# Altium schematic sheet ADS1298_2.SchDoc
size A4
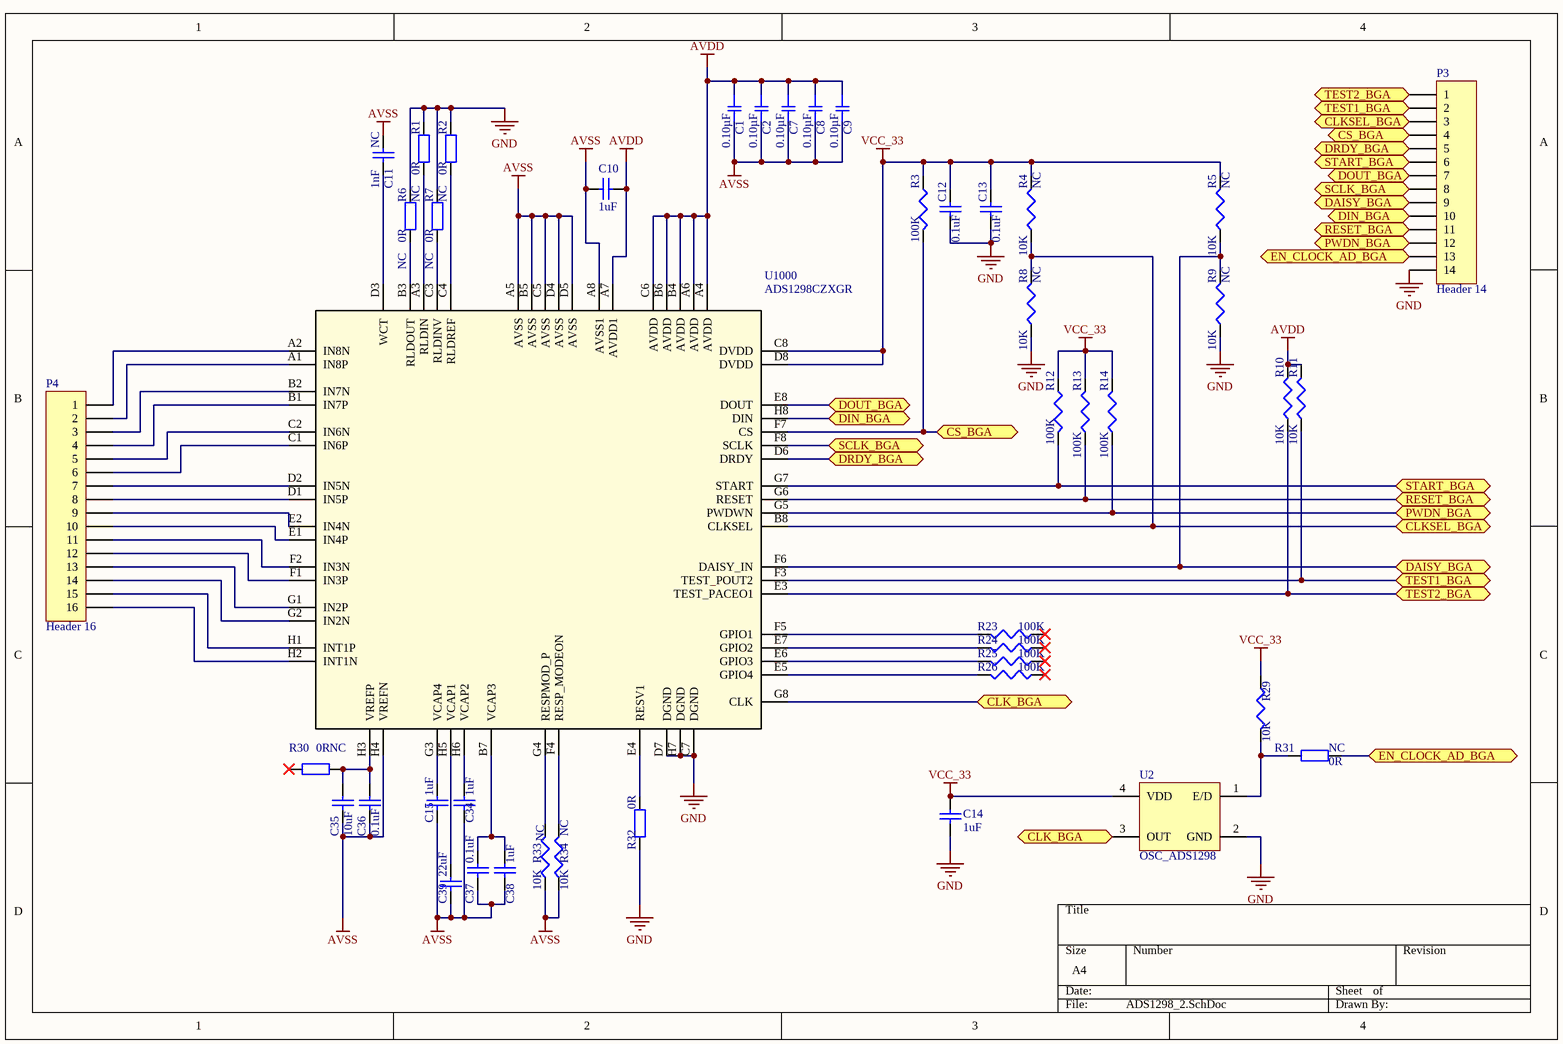
[diagram p0: ADS1298_2.SchDoc]

## Parts
C1  0.10µF  [SMD-0201C]
C2  0.10µF  [SMD-0201C]
C7  0.10µF  [SMD-0201C]
C8  0.10µF  [SMD-0201C]
C9  0.10µF  [SMD-0201C]
C10  value 1uF  [cap_0402_R - modified]  (hidden comment: Cap)
C11  NC  value 1nF  [cap_0402_R - modified]
C12  value 0.1uF  [cap_0402_R - modified]  (hidden comment: Cap)
C13  value 0.1uF  [cap_0402_R - modified]  (hidden comment: Cap)
C14  value 1uF  [cap_0402_R - modified]  (hidden comment: Cap)
C15  value 1uF  [cap_0402_R - modified]  (hidden comment: Cap)
C34  value 1uF  [cap_0402_R - modified]  (hidden comment: Cap)
C35  value 10uF  [cap_0402_R - modified]  (hidden comment: Cap)
C36  value 0.1uF  [cap_0402_R - modified]  (hidden comment: Cap)
C37  value 0.1uF  [cap_0402_R - modified]  (hidden comment: Cap)
C38  value 1uF  [cap_0402_R - modified]  (hidden comment: Cap)
C39  value 22uF  [cap_0402_R - modified]  (hidden comment: Cap)
P3  Header 14  [61301421121]
P4  Header 16  [61301621121]
R1  NC  value 0R  [cap_0402_R - modified]
R2  NC  value 0R  [cap_0402_R - modified]
R3  value 100K  [res_0402_R - modified]  (hidden comment: Res3)
R4  NC  value 10K  [cap_0402_R - modified]
R5  NC  value 10K  [cap_0402_R - modified]
R6  NC  value 0R  [cap_0402_R - modified]
R7  NC  value 0R  [cap_0402_R - modified]
R8  NC  value 10K  [cap_0402_R - modified]
R9  NC  value 10K  [cap_0402_R - modified]
R10  value 10K  [cap_0402_R - modified]
R11  value 10K  [cap_0402_R - modified]
R12  value 100K  [res_0402_R - modified]  (hidden comment: Res3)
R13  value 100K  [res_0402_R - modified]  (hidden comment: Res3)
R14  value 100K  [res_0402_R - modified]  (hidden comment: Res3)
R23  value 100K  [res_0402_R - modified]  (hidden comment: Res3)
R24  value 100K  [res_0402_R - modified]  (hidden comment: Res3)
R25  value 100K  [res_0402_R - modified]  (hidden comment: Res3)
R26  value 100K  [res_0402_R - modified]  (hidden comment: Res3)
R29  value 10K  [res_0402_R - modified]  (hidden comment: Res3)
R30  NC  value 0R  [cap_0402_R - modified]
R31  NC  value 0R  [cap_0402_R - modified]
R32  value 0R  [cap_0402_R - modified]
R33  NC  value 10K  [cap_0402_R - modified]
R34  NC  value 10K  [res_0402_R - modified]
U2  OSC_ADS1298  [HC735 - OSC ADS1298]
U1000  ADS1298CZXGR  [BGA64C80P8X8_800X800X106]

## Ports
CLK_BGA, CLKSEL_BGA, CS_BGA, DAISY_BGA, DIN_BGA, DOUT_BGA, DRDY_BGA, EN_CLOCK_AD_BGA (bidir), PWDN_BGA, RESET_BGA, SCLK_BGA, START_BGA, TEST1_BGA, TEST2_BGA

## Nets
AVDD: C1.1 C2.1 C7.1 C8.1 C9.1 C10.1 R10.2 R11.2 U1000.A4(AVDD) U1000.A6(AVDD) U1000.A7(AVDD1) U1000.B4(AVDD) U1000.B6(AVDD) U1000.C6(AVDD)
AVSS: C1.2 C2.2 C7.2 C8.2 C9.2 C10.2 C11.1 C15.1 C34.1 C35.1 C36.1 C37.1 C38.1 C39.1 R33.1 R34.1 U1000.A5(AVSS) U1000.A8(AVSS1) U1000.B5(AVSS) U1000.C5(AVSS) U1000.D4(AVSS) U1000.D5(AVSS) U1000.H4(VREFN)
GND: C12.1 C13.1 C14.2 P3.14 R1.1 R2.1 R6.1 R7.1 R8.1 R9.1 R32.2 U2.2(GND) U1000.C7(DGND) U1000.D7(DGND) U1000.H7(DGND)
VCC_33: C12.2 C13.2 C14.1 R3.1 R4.2 R5.2 R12.1 R13.2 R14.2 R29.1 U2.4(VDD) U1000.C8(DVDD) U1000.D8(DVDD)
CLK_BGA: U2.3(OUT) U1000.G8(CLK) ; port CLK_BGA
CLKSEL_BGA: P3.3 R4.1 R8.2 U1000.B8(CLKSEL) ; port CLKSEL_BGA
CS_BGA: P3.4 R3.2 U1000.F7(CS) ; port CS_BGA
DAISY_BGA: P3.9 R5.1 R9.2 U1000.F6(DAISY_IN) ; port DAISY_BGA
DIN_BGA: P3.10 U1000.H8(DIN) ; port DIN_BGA
DOUT_BGA: P3.7 U1000.E8(DOUT) ; port DOUT_BGA
DRDY_BGA: P3.5 U1000.D6(DRDY) ; port DRDY_BGA
EN_CLOCK_AD_BGA: P3.13 R31.1 ; port EN_CLOCK_AD_BGA
PWDN_BGA: P3.12 R14.1 U1000.G5(PWDWN) ; port PWDN_BGA
RESET_BGA: P3.11 R13.1 U1000.G6(RESET) ; port RESET_BGA
SCLK_BGA: P3.8 U1000.F8(SCLK) ; port SCLK_BGA
START_BGA: P3.6 R12.2 U1000.G7(START) ; port START_BGA
TEST1_BGA: P3.2 R11.1 U1000.F3(TEST_POUT2) ; port TEST1_BGA
TEST2_BGA: P3.1 R10.1 U1000.E3(TEST_PACEO1) ; port TEST2_BGA
NetC11_2: C11.2 U1000.D3(WCT)
NetC15_2: C15.2 U1000.G3(VCAP4)
NetC34_2: C34.2 U1000.H6(VCAP2)
NetC35_2: C35.2 C36.2 R30.2 U1000.H3(VREFP)
NetC37_2: C37.2 C38.2 U1000.B7(VCAP3)
NetC39_2: C39.2 U1000.H5(VCAP1)
NetP4_1: P4.1 U1000.A2(IN8N)
NetP4_2: P4.2 U1000.A1(IN8P)
NetP4_3: P4.3 U1000.B2(IN7N)
NetP4_4: P4.4 U1000.B1(IN7P)
NetP4_5: P4.5 U1000.C2(IN6N)
NetP4_6: P4.6 U1000.C1(IN6P)
NetP4_7: P4.7 U1000.D2(IN5N)
NetP4_8: P4.8 U1000.D1(IN5P)
NetP4_9: P4.9 U1000.E2(IN4N)
NetP4_10: P4.10 U1000.E1(IN4P)
NetP4_11: P4.11 U1000.F2(IN3N)
NetP4_12: P4.12 U1000.F1(IN3P)
NetP4_13: P4.13 U1000.G1(IN2P)
NetP4_14: P4.14 U1000.G2(IN2N)
NetP4_15: P4.15 U1000.H1(INT1P)
NetP4_16: P4.16 U1000.H2(INT1N)
NetR1_2: R1.2 U1000.A3(RLDIN)
NetR2_2: R2.2 U1000.C4(RLDREF)
NetR6_2: R6.2 U1000.B3(RLDOUT)
NetR7_2: R7.2 U1000.C3(RLDINV)
NetR23_2: R23.2 U1000.F5(GPIO1)
NetR24_2: R24.2 U1000.E7(GPIO2)
NetR25_2: R25.2 U1000.E6(GPIO3)
NetR26_2: R26.2 U1000.E5(GPIO4)
NetR29_2: R29.2 R31.2 U2.1(E/D)
NetR32_1: R32.1 U1000.E4(RESV1)
NetR33_2: R33.2 U1000.G4(RESPMOD_P)
NetR34_2: R34.2 U1000.F4(RESP_MODEON)

Not connected (* = marked no-connect by the designer): R23 1*; R24 1*; R25 1*; R26 1*; R30 1*

## Library data of the parts
C1 C2 C7-C9 = GRT033C81A104KE01D: CAP CER 0.1UF 10V X6S 0201; Manufacturer: Murata Electronics North America; Factory Stock: 0; Unit Price (USD): 0.1; Minimum Quantity: 1; Tolerance: ±10%; Datasheets: http://search.murata.co.jp/Ceramy/image/img/A01X/G101/ENG/GRT033C81A104KE01-01.pdf; Image: //media.digikey.com/Renders/Murata%20Renders/GRT%20Series%200201%20(0603%20Metric).jpg; Digi-Key Part Number: 490-12232-1-ND; Part Number: GRT033C81A104KE01D; Quantity Available: 1647; @ qty: 0; Packaging: Cut Tape (CT); Series: GRT; Part Status: Active; Value: 0.10µF; Voltage: 10V; Temperature Coefficient: X6S; Operating Temperature: -55°C ~ 105°C; Features: -; Ratings: AEC-Q200; Applications: Automotive; Failure Rate: Surface Mount, MLCC; Mounting Type: 0201 (0603 Metric); Package / Case: 0.024" L x 0.012" W (0.60mm x 0.30mm); Size / Dimension: -; Height - Seated (Max): 0.013" (0.33mm); Thickness (Max): -; Lead Spacing: -
C10-C15 C34-C39 = Cap: Capacitor; Published: 8-Jun-2000; LatestRevisionDate: 17-Jul-2002; LatestRevisionNote: Re-released for DXP Platform.; PackageReference: RAD-0.3; Publisher: Altium Limited; PackageDescription: Radial Cap, Thru-Hole; 2 Leads; 0.3 in Pin Spacing
P3 = Header 14: Header, 14-Pin; LatestRevisionDate: 17-Jul-2002; LatestRevisionNote: Re-released for DXP Platform.; Publisher: Altium Limited
P4 = Header 16: Header, 16-Pin; LatestRevisionDate: 17-Jul-2002; LatestRevisionNote: Re-released for DXP Platform.; Publisher: Altium Limited
R1 R2 R6 R7 R30-R32 = Res2: Resistor; Published: 8-Jun-2000; LatestRevisionDate: 17-Jul-2002; LatestRevisionNote: Re-released for DXP Platform.; PackageReference: AXIAL-0.4; Publisher: Altium Limited; PackageDescription: Axial Device, Thru-Hole; 2 Leads; 0.4 in Pin Spacing
R3-R5 R8-R14 R23-R26 R29 R33 R34 = Res3: Resistor; Published: 8-Jun-2000; LatestRevisionDate: 29-May-2009; LatestRevisionNote: IPC-7351 Footprint Added.; PackageReference: J1-0603; Publisher: Altium Limited; PackageDescription: Chip Resistor
U2 = OSC_ADS1298: Linear Regulator
U1000 = ADS1298CZXGR: 8-Channel, 24-Bit Analog-To-Digital Converter With Integrated ECG Front End; Manufacturer: Texas Instruments; INDUSTRY_STD_PKG_TYPE: NFBGA; FAMILY_NAME: ECG / EEG Analog Front End; PIN_COUNT: 64; PACKAGE_DESIGNATOR: ZXG; Datasheet_URL: http://www.ti.com/lit/gpn/ADS1298; GENERIC_PART_NUMBER: ADS1298; Copyright: Copyright (C) 2018 Accelerated Designs. All rights reserved; RefDes: RefDes; Type: DEV